# Altium project rtm-lamp.PrjPcb (part 4 of 6)

## Sheet shift-registers.SchDoc: Shift Registers
size A3; DrawnBy: Augusto Fraga Giachero; DocumentNumber: 6; SheetNumber: 6; SheetTotal: 9
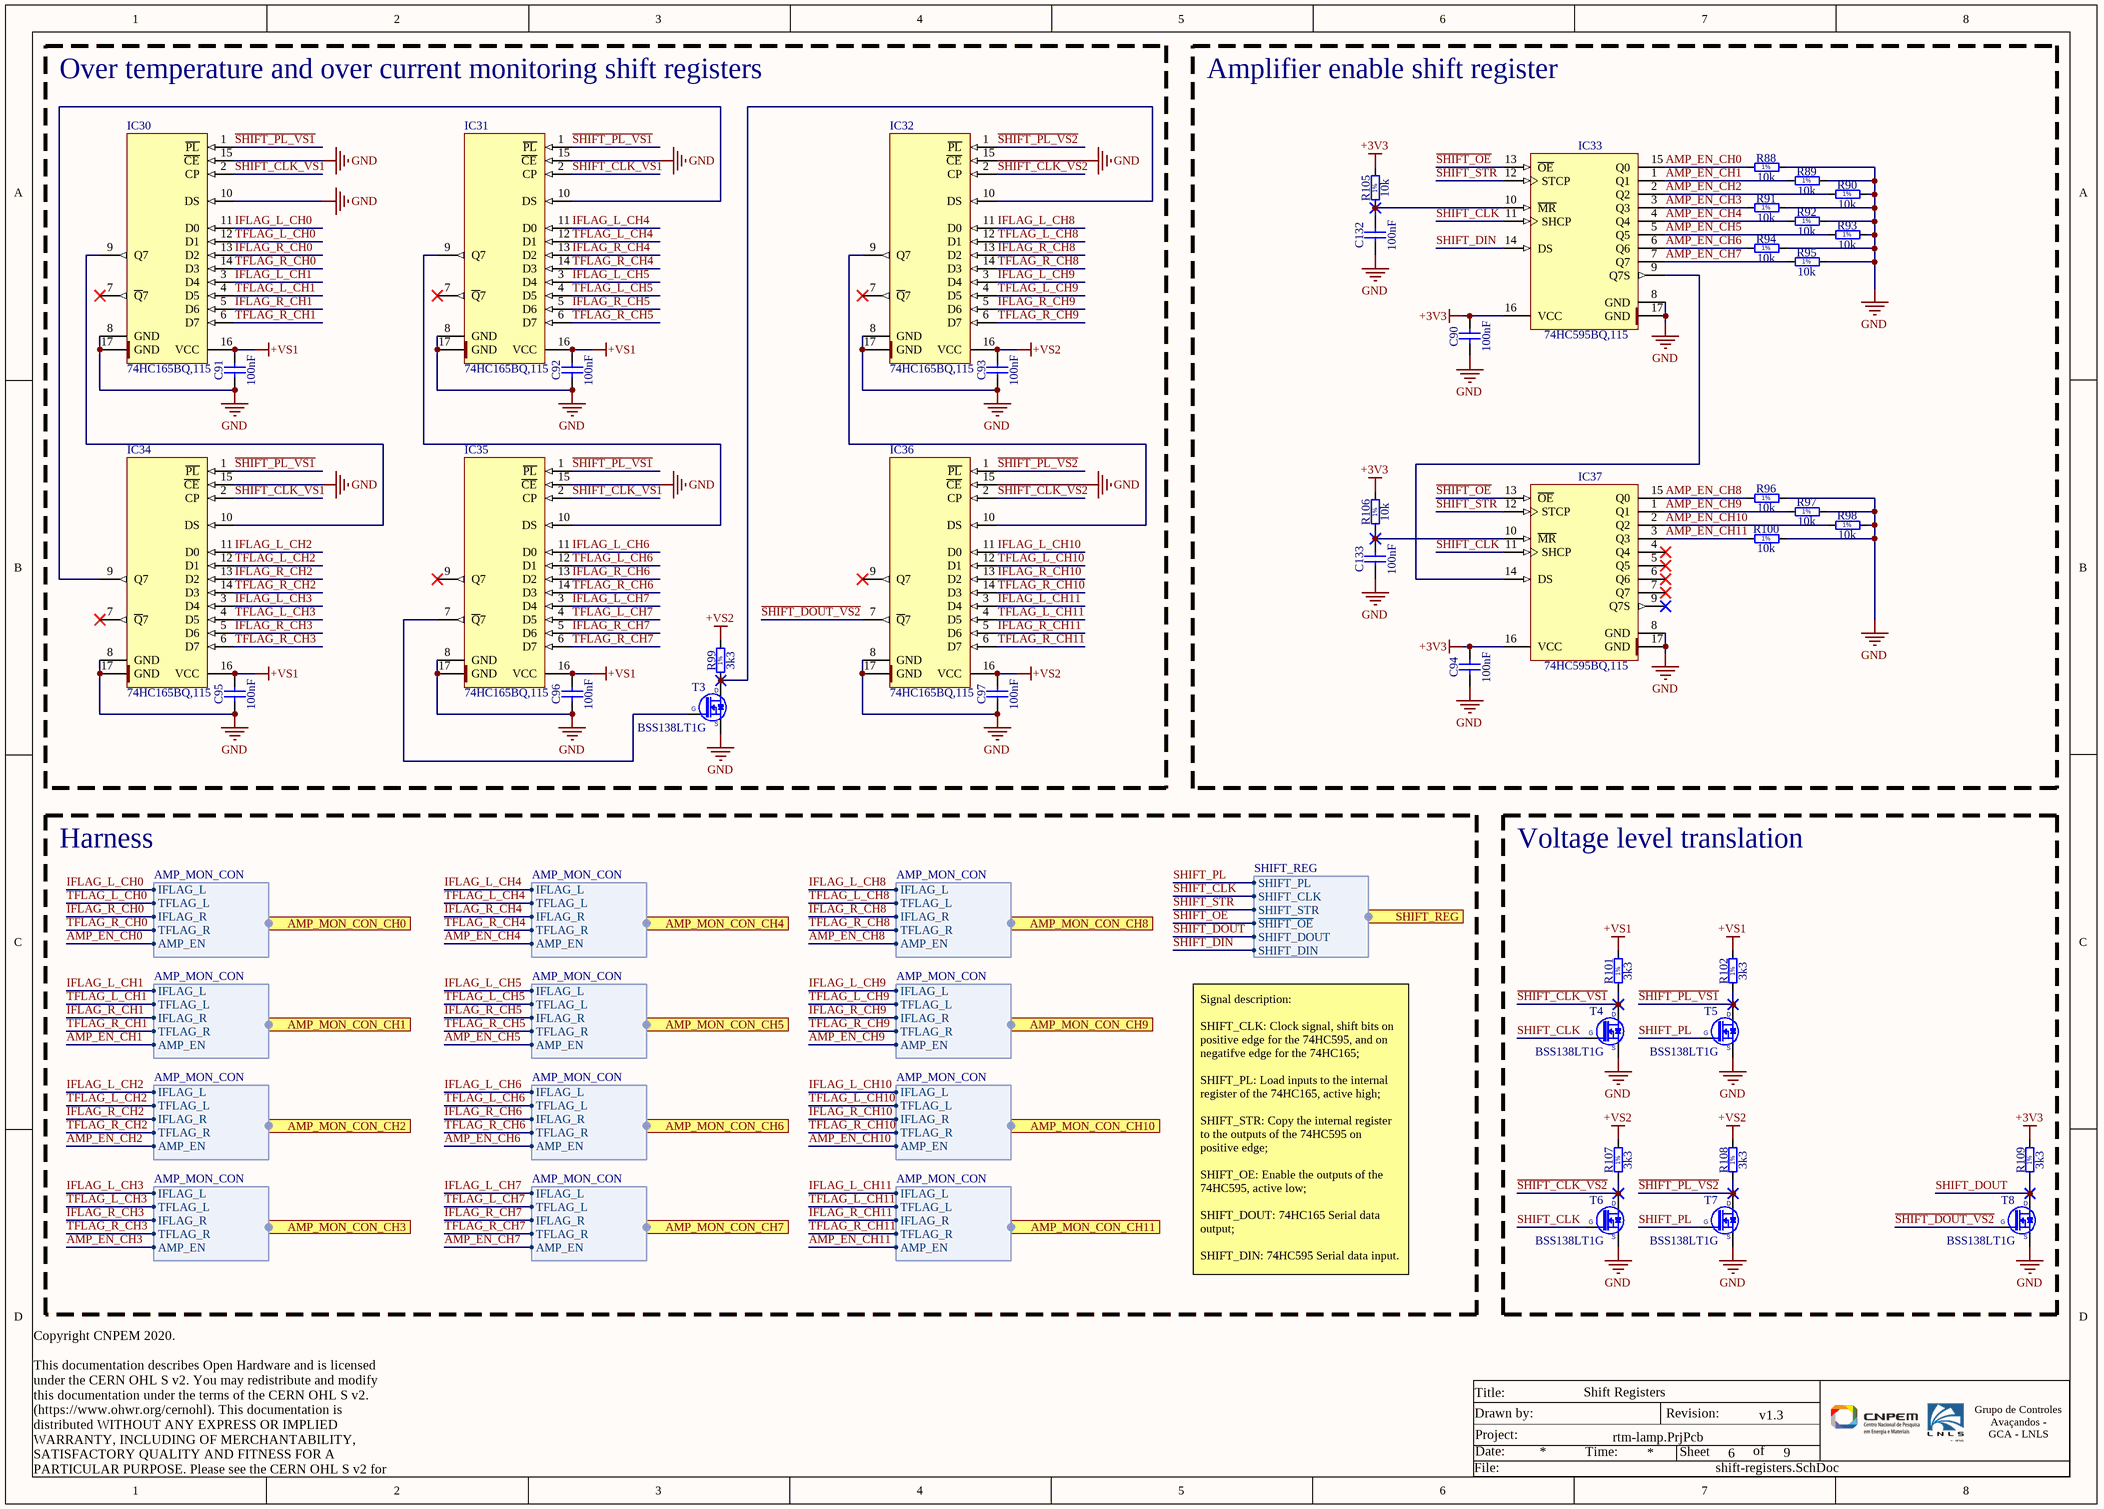
[diagram p4: shift-registers.SchDoc]

### Parts
C90  100nF  [CAPC1005X55N]
C91  100nF  [CAPC1005X55N]
C92  100nF  [CAPC1005X55N]
C93  100nF  [CAPC1005X55N]
C94  100nF  [CAPC1005X55N]
C95  100nF  [CAPC1005X55N]
C96  100nF  [CAPC1005X55N]
C97  100nF  [CAPC1005X55N]
C132  100nF  [CAPC1005X55N]
C133  100nF  [CAPC1005X55N]
IC30  74HC165BQ,115  [DHVQFN16]
IC31  74HC165BQ,115  [DHVQFN16]
IC32  74HC165BQ,115  [DHVQFN16]
IC33  74HC595BQ,115  [DHVQFN16]
IC34  74HC165BQ,115  [DHVQFN16]
IC35  74HC165BQ,115  [DHVQFN16]
IC36  74HC165BQ,115  [DHVQFN16]
IC37  74HC595BQ,115  [DHVQFN16]
R88  10k  [RESC1005X40N]
R89  10k  [RESC1005X40N]
R90  10k  [RESC1005X40N]
R91  10k  [RESC1005X40N]
R92  10k  [RESC1005X40N]
R93  10k  [RESC1005X40N]
R94  10k  [RESC1005X40N]
R95  10k  [RESC1005X40N]
R96  10k  [RESC1005X40N]
R97  10k  [RESC1005X40N]
R98  10k  [RESC1005X40N]
R99  3k3  [RESC1005X40N]
R100  10k  [RESC1005X40N]
R101  3k3  [RESC1005X40N]
R102  3k3  [RESC1005X40N]
R105  10k  [RESC1005X40N]
R106  10k  [RESC1005X40N]
R107  3k3  [RESC1005X40N]
R108  3k3  [RESC1005X40N]
R109  3k3  [RESC1005X40N]
T3  BSS138LT1G  [SOT95P240X110-3N]
T4  BSS138LT1G  [SOT95P240X110-3N]
T5  BSS138LT1G  [SOT95P240X110-3N]
T6  BSS138LT1G  [SOT95P240X110-3N]
T7  BSS138LT1G  [SOT95P240X110-3N]
T8  BSS138LT1G  [SOT95P240X110-3N]

### Blocks framed on the sheet
Over temperature and over current monitoring shift registers: C91-C93 C95-C97 IC30-IC32 IC34-IC36 R99 T3
Amplifier enable shift register: C90 C94 C132 C133 IC33 IC37 R88-R98 R100 R105 R106
Voltage level translation: R101 R102 R107-R109 T4-T8

### Ports
AMP_MON_CON_CH0 (harness AMP_MON_CON), AMP_MON_CON_CH1 (harness AMP_MON_CON), AMP_MON_CON_CH2 (harness AMP_MON_CON), AMP_MON_CON_CH3 (harness AMP_MON_CON), AMP_MON_CON_CH4 (harness AMP_MON_CON), AMP_MON_CON_CH5 (harness AMP_MON_CON), AMP_MON_CON_CH6 (harness AMP_MON_CON), AMP_MON_CON_CH7 (harness AMP_MON_CON), AMP_MON_CON_CH8 (harness AMP_MON_CON), AMP_MON_CON_CH9 (harness AMP_MON_CON), AMP_MON_CON_CH10 (harness AMP_MON_CON), AMP_MON_CON_CH11 (harness AMP_MON_CON), SHIFT_REG (out, harness SHIFT_REG)

### Harnesses
AMP_MON_CON: IFLAG_L, TFLAG_L, IFLAG_R, TFLAG_R, AMP_EN
SHIFT_REG: SHIFT_PL, SHIFT_CLK, SHIFT_STR, ~{SHIFT_OE}, SHIFT_DOUT, SHIFT_DIN

### Nets
+3V3: C90.2 C94.2 IC33.16(VCC) IC37.16(VCC) R105.2 R106.2 R109.2
+VS1: C91.2 C92.2 C95.2 C96.2 IC30.16(VCC) IC31.16(VCC) IC34.16(VCC) IC35.16(VCC) R101.2 R102.2
+VS2: C93.2 C97.2 IC32.16(VCC) IC36.16(VCC) R99.2 R107.2 R108.2
GND: C90.1 C91.1 C92.1 C93.1 C94.1 C95.1 C96.1 C97.1 C132.1 C133.1 IC30.8(GND) IC30.10(DS) IC30.15(~{CE}) IC30.17(GND) IC31.8(GND) IC31.15(~{CE}) IC31.17(GND) IC32.8(GND) IC32.15(~{CE}) IC32.17(GND) IC33.8(GND) IC33.17(GND) IC34.8(GND) IC34.15(~{CE}) IC34.17(GND) IC35.8(GND) IC35.15(~{CE}) IC35.17(GND) IC36.8(GND) IC36.15(~{CE}) IC36.17(GND) IC37.8(GND) IC37.17(GND) R88.2 R89.2 R90.2 R91.2 R92.2 R93.2 R94.2 R95.2 R96.2 R97.2 R98.2 R100.2 T3.2(S) T4.2(S) T5.2(S) T6.2(S) T7.2(S) T8.2(S)
AMP_EN_CH0: IC33.15(Q0) R88.1 ; port AMP_MON_CON_CH0.AMP_EN  [project net AMP_EN]
AMP_EN_CH1: IC33.1(Q1) R89.1 ; port AMP_MON_CON_CH1.AMP_EN  [project net AMP_EN]
AMP_EN_CH2: IC33.2(Q2) R90.1 ; port AMP_MON_CON_CH2.AMP_EN  [project net AMP_EN]
AMP_EN_CH3: IC33.3(Q3) R91.1 ; port AMP_MON_CON_CH3.AMP_EN  [project net AMP_EN]
AMP_EN_CH4: IC33.4(Q4) R92.1 ; port AMP_MON_CON_CH4.AMP_EN  [project net AMP_EN]
AMP_EN_CH5: IC33.5(Q5) R93.1 ; port AMP_MON_CON_CH5.AMP_EN  [project net AMP_EN]
AMP_EN_CH6: IC33.6(Q6) R94.1 ; port AMP_MON_CON_CH6.AMP_EN  [project net AMP_EN]
AMP_EN_CH7: IC33.7(Q7) R95.1 ; port AMP_MON_CON_CH7.AMP_EN  [project net AMP_EN]
AMP_EN_CH8: IC37.15(Q0) R96.1 ; port AMP_MON_CON_CH8.AMP_EN  [project net AMP_EN]
AMP_EN_CH9: IC37.1(Q1) R97.1 ; port AMP_MON_CON_CH9.AMP_EN  [project net AMP_EN]
AMP_EN_CH10: IC37.2(Q2) R98.1 ; port AMP_MON_CON_CH10.AMP_EN  [project net AMP_EN]
AMP_EN_CH11: IC37.3(Q3) R100.1 ; port AMP_MON_CON_CH11.AMP_EN  [project net AMP_EN]
IFLAG_L_CH0: IC30.11(D0) ; port AMP_MON_CON_CH0.IFLAG_L  [project net IFLAG_L]
IFLAG_L_CH1: IC30.3(D4) ; port AMP_MON_CON_CH1.IFLAG_L  [project net IFLAG_L]
IFLAG_L_CH2: IC34.11(D0) ; port AMP_MON_CON_CH2.IFLAG_L  [project net IFLAG_L]
IFLAG_L_CH3: IC34.3(D4) ; port AMP_MON_CON_CH3.IFLAG_L  [project net IFLAG_L]
IFLAG_L_CH4: IC31.11(D0) ; port AMP_MON_CON_CH4.IFLAG_L  [project net IFLAG_L]
IFLAG_L_CH5: IC31.3(D4) ; port AMP_MON_CON_CH5.IFLAG_L  [project net IFLAG_L]
IFLAG_L_CH6: IC35.11(D0) ; port AMP_MON_CON_CH6.IFLAG_L  [project net IFLAG_L]
IFLAG_L_CH7: IC35.3(D4) ; port AMP_MON_CON_CH7.IFLAG_L  [project net IFLAG_L]
IFLAG_L_CH8: IC32.11(D0) ; port AMP_MON_CON_CH8.IFLAG_L  [project net IFLAG_L]
IFLAG_L_CH9: IC32.3(D4) ; port AMP_MON_CON_CH9.IFLAG_L  [project net IFLAG_L]
IFLAG_L_CH10: IC36.11(D0) ; port AMP_MON_CON_CH10.IFLAG_L  [project net IFLAG_L]
IFLAG_L_CH11: IC36.3(D4) ; port AMP_MON_CON_CH11.IFLAG_L  [project net IFLAG_L]
IFLAG_R_CH0: IC30.13(D2) ; port AMP_MON_CON_CH0.IFLAG_R  [project net IFLAG_R]
IFLAG_R_CH1: IC30.5(D6) ; port AMP_MON_CON_CH1.IFLAG_R  [project net IFLAG_R]
IFLAG_R_CH2: IC34.13(D2) ; port AMP_MON_CON_CH2.IFLAG_R  [project net IFLAG_R]
IFLAG_R_CH3: IC34.5(D6) ; port AMP_MON_CON_CH3.IFLAG_R  [project net IFLAG_R]
IFLAG_R_CH4: IC31.13(D2) ; port AMP_MON_CON_CH4.IFLAG_R  [project net IFLAG_R]
IFLAG_R_CH5: IC31.5(D6) ; port AMP_MON_CON_CH5.IFLAG_R  [project net IFLAG_R]
IFLAG_R_CH6: IC35.13(D2) ; port AMP_MON_CON_CH6.IFLAG_R  [project net IFLAG_R]
IFLAG_R_CH7: IC35.5(D6) ; port AMP_MON_CON_CH7.IFLAG_R  [project net IFLAG_R]
IFLAG_R_CH8: IC32.13(D2) ; port AMP_MON_CON_CH8.IFLAG_R  [project net IFLAG_R]
IFLAG_R_CH9: IC32.5(D6) ; port AMP_MON_CON_CH9.IFLAG_R  [project net IFLAG_R]
IFLAG_R_CH10: IC36.13(D2) ; port AMP_MON_CON_CH10.IFLAG_R  [project net IFLAG_R]
IFLAG_R_CH11: IC36.5(D6) ; port AMP_MON_CON_CH11.IFLAG_R  [project net IFLAG_R]
~{SHIFT_CLK_VS1}: IC30.2(CP) IC31.2(CP) IC34.2(CP) IC35.2(CP) R101.1 T4.3(D)
~{SHIFT_CLK_VS2}: IC32.2(CP) IC36.2(CP) R107.1 T6.3(D)
~{SHIFT_DOUT_VS2}: IC36.7(~{Q}7) T8.1(G)
~{SHIFT_OE}: IC33.13(~{OE}) IC37.13(~{OE}) ; port SHIFT_REG.~{SHIFT_OE}
~{SHIFT_PL_VS1}: IC30.1(~{PL}) IC31.1(~{PL}) IC34.1(~{PL}) IC35.1(~{PL}) R102.1 T5.3(D)
~{SHIFT_PL_VS2}: IC32.1(~{PL}) IC36.1(~{PL}) R108.1 T7.3(D)
SHIFT_CLK: IC33.11(SHCP) IC37.11(SHCP) T4.1(G) T6.1(G) ; port SHIFT_REG.SHIFT_CLK
SHIFT_DIN: IC33.14(DS) ; port SHIFT_REG.SHIFT_DIN
SHIFT_DOUT: R109.1 T8.3(D) ; port SHIFT_REG.SHIFT_DOUT
SHIFT_PL: T5.1(G) T7.1(G) ; port SHIFT_REG.SHIFT_PL  [project net P30_IO5_CD_B1_N]
SHIFT_STR: IC33.12(STCP) IC37.12(STCP) ; port SHIFT_REG.SHIFT_STR
TFLAG_L_CH0: IC30.12(D1) ; port AMP_MON_CON_CH0.TFLAG_L  [project net TFLAG_L]
TFLAG_L_CH1: IC30.4(D5) ; port AMP_MON_CON_CH1.TFLAG_L  [project net TFLAG_L]
TFLAG_L_CH2: IC34.12(D1) ; port AMP_MON_CON_CH2.TFLAG_L  [project net TFLAG_L]
TFLAG_L_CH3: IC34.4(D5) ; port AMP_MON_CON_CH3.TFLAG_L  [project net TFLAG_L]
TFLAG_L_CH4: IC31.12(D1) ; port AMP_MON_CON_CH4.TFLAG_L  [project net TFLAG_L]
TFLAG_L_CH5: IC31.4(D5) ; port AMP_MON_CON_CH5.TFLAG_L  [project net TFLAG_L]
TFLAG_L_CH6: IC35.12(D1) ; port AMP_MON_CON_CH6.TFLAG_L  [project net TFLAG_L]
TFLAG_L_CH7: IC35.4(D5) ; port AMP_MON_CON_CH7.TFLAG_L  [project net TFLAG_L]
TFLAG_L_CH8: IC32.12(D1) ; port AMP_MON_CON_CH8.TFLAG_L  [project net TFLAG_L]
TFLAG_L_CH9: IC32.4(D5) ; port AMP_MON_CON_CH9.TFLAG_L  [project net TFLAG_L]
TFLAG_L_CH10: IC36.12(D1) ; port AMP_MON_CON_CH10.TFLAG_L  [project net TFLAG_L]
TFLAG_L_CH11: IC36.4(D5) ; port AMP_MON_CON_CH11.TFLAG_L  [project net TFLAG_L]
TFLAG_R_CH0: IC30.14(D3) ; port AMP_MON_CON_CH0.TFLAG_R  [project net TFLAG_R]
TFLAG_R_CH1: IC30.6(D7) ; port AMP_MON_CON_CH1.TFLAG_R  [project net TFLAG_R]
TFLAG_R_CH2: IC34.14(D3) ; port AMP_MON_CON_CH2.TFLAG_R  [project net TFLAG_R]
TFLAG_R_CH3: IC34.6(D7) ; port AMP_MON_CON_CH3.TFLAG_R  [project net TFLAG_R]
TFLAG_R_CH4: IC31.14(D3) ; port AMP_MON_CON_CH4.TFLAG_R  [project net TFLAG_R]
TFLAG_R_CH5: IC31.6(D7) ; port AMP_MON_CON_CH5.TFLAG_R  [project net TFLAG_R]
TFLAG_R_CH6: IC35.14(D3) ; port AMP_MON_CON_CH6.TFLAG_R  [project net TFLAG_R]
TFLAG_R_CH7: IC35.6(D7) ; port AMP_MON_CON_CH7.TFLAG_R  [project net TFLAG_R]
TFLAG_R_CH8: IC32.14(D3) ; port AMP_MON_CON_CH8.TFLAG_R  [project net TFLAG_R]
TFLAG_R_CH9: IC32.6(D7) ; port AMP_MON_CON_CH9.TFLAG_R  [project net TFLAG_R]
TFLAG_R_CH10: IC36.14(D3) ; port AMP_MON_CON_CH10.TFLAG_R  [project net TFLAG_R]
TFLAG_R_CH11: IC36.6(D7) ; port AMP_MON_CON_CH11.TFLAG_R  [project net TFLAG_R]
NetC132_2: C132.2 IC33.10(~{MR}) R105.1
NetC133_2: C133.2 IC37.10(~{MR}) R106.1
NetIC30_9: IC30.9(Q7) IC34.10(DS)
NetIC31_9: IC31.9(Q7) IC35.10(DS)
NetIC31_10: IC31.10(DS) IC34.9(Q7)
NetIC32_9: IC32.9(Q7) IC36.10(DS)
NetIC32_10: IC32.10(DS) R99.1 T3.3(D)
NetIC33_9: IC33.9(Q7S) IC37.14(DS)
NetIC35_7: IC35.7(~{Q}7) T3.1(G)

Not connected (* = marked no-connect by the designer): IC30 7(~{Q}7)*; IC31 7(~{Q}7)*; IC32 7(~{Q}7)*; IC34 7(~{Q}7)*; IC35 9(Q7)*; IC36 9(Q7)*; IC37 4(Q4)* 5(Q5)* 6(Q6)* 7(Q7)* 9(Q7S)*

### Notes on the sheet
- Harness
- Signal description:
  SHIFT_CLK: Clock signal, shift bits on positive edge for the 74HC595, and on negatifve edge for the 74HC165;
  SHIFT_PL: Load inputs to the internal register of the 74HC165, active high;
  SHIFT_STR: Copy the internal register to the outputs of the 74HC595 on positive edge;
  SHIFT_OE: Enable the outputs of the 74HC595, active low;
  SHIFT_DOUT: 74HC165 Serial data output;
  SHIFT_DIN: 74HC595 Serial data input.
- Title:
- Date:
- Project:
- Drawn by:
- Time:
- Revision:
- Sheet
- of
- Grupo de Controles Avaçandos -
  GCA - LNLS
- Copyright CNPEM 2020.
  This documentation describes Open Hardware and is licensed under the CERN OHL S v2. You may redistribute and modify this documentation under the terms of the CERN OHL S v2. (https://www.ohwr.org/cernohl). This documentation is distributed WITHOUT ANY EXPRESS OR IMPLIED WARRANTY, INCLUDING OF MERCHANTABILITY, SATISFACTORY QUALITY AND FITNESS FOR A PARTICULAR PURPOSE. Please see the CERN OHL S v2 for applicable conditions.
- File:
- (in symbol R0402_3K3_1%_0.0625W_100PPM) 1%
- (in symbol R0402_10K_1%_0.0625W_100PPM) 1%

### Library data of the parts
C90-C97 C132 C133 = CC0402_100NF_16V_10%_X7R: SMD Multilayer Chip Ceramic Capacitor; Manufacturer: GENERIC; Manufacturer1 Part Number: GRM155R71C104KA88D; Voltage: 16V; TC: X7R; Tolerance: ±10%; Part Number: CC0402_100NF_16V_10%_X7R; Component Kind: Standard; Component Type: Standard; Pin Count: 2; Value: 100nF; Status: Not Recommended; Manufacturer Part Number: CC0402_100NF_16V_10%_X7R; Case: 0402; Mounted: Yes; Socket: No; SMD: Yes; Sense: No; Manufacturer1 Example: MURATA; Manufacturer1 ComponentHeight: 0.55mm; HelpURL: \\cern.ch\dfs\Applications\Altium\Datasheets\CC0402_X7R_MURATA_GRM.pdf; Author: CERN DEM JLC; CreateDate: 05/12/2013; LatestRevisionDate: 03/12/2007
IC30-IC32 IC34-IC36 = 74HC165BQ,115: 8-bit parallel-in/serial out shift register; Manufacturer: NEXPERIA; PressFit: No; Bonding: No; Part Number: 74HC165BQ,115; Component Kind: Standard; Component Type: Standard; Device: 74HC165BQ,115; Footprint: DHVQFN-16; PackageDescription: Plastic dual in-line compatible thermal enhanced very thin quad flat package, no leads, 16 terminals, body 2.5 x 3.5 x 0.85 mm; Manufacturer Part Number: 74HC165BQ,115; Pin Count: 17; Case: DHVQFN-16; Mounted: Yes; Socket: No; SMD: Yes; Sense: No; ComponentHeight: 1mm; Author: LNLS DIG AFG; CreateDate: 03/07/2020; LatestRevisionDate: 03/07/2020
IC33 IC37 = 74HC595BQ,115: 8-Bit serial-in, serial or parallel-out shift register with output  latches, Three-state; Manufacturer: NEXPERIA; PressFit: No; Bonding: No; Part Number: 74HC595BQ,115; Component Kind: Standard; Component Type: Standard; Device: 74HC595BQ,115; PackageDescription: Plastic dual in-line compatible thermal enhanced very thin quad flat package, no leads, 16 terminals, body 2.5 x 3.5 x 0.85 mm; Manufacturer Part Number: 74HC595BQ,115; Pin Count: 17; Case: DHVQFN-16; Mounted: Yes; Socket: No; SMD: Yes; Sense: No; ComponentHeight: 1mm; Author: LNLS DIG AFG; CreateDate: 06/07/2020; LatestRevisionDate: 06/07/2020
R88-R98 R100 R105 R106 = R0402_10K_1%_0.0625W_100PPM: General Purpose Thick Film Chip Resistor; Manufacturer: GENERIC; Manufacturer1 Part Number: 232270671003L; TC: ±100ppm/°C; Tolerance: ±1%; Part Number: R0402_10K_1%_0.0625W_100PPM; Component Kind: Standard; Component Type: Standard; Pin Count: 2; Value: 10k; Status: Not recommended; Power: 0.0625W; Manufacturer Part Number: R0402_10K_1%_0.0625W_100PPM; Case: 0402; Mounted: Yes; Sense: No; Socket: No; SMD: Yes; Manufacturer1 Example: YAGEO PHYCOMP; Manufacturer1 ComponentHeight: 0.4mm; HelpURL: \\cern.ch\dfs\Applications\Altium\Datasheets\R0402_Phycomp_RC0402.pdf; Author: CERN DEM JLC; CreateDate: 03/12/2007; LatestRevisionDate: 17/10/2012
R99 R101 R102 R107-R109 = R0402_3K3_1%_0.0625W_100PPM: General Purpose Thick Film Chip Resistor; Manufacturer: GENERIC; Manufacturer1 Part Number: 232270673302L; TC: ±100ppm/°C; Tolerance: ±1%; Part Number: R0402_3K3_1%_0.0625W_100PPM; Component Kind: Standard; Component Type: Standard; Pin Count: 2; Value: 3k3; Status: Not recommended; Power: 0.0625W; Manufacturer Part Number: R0402_3K3_1%_0.0625W_100PPM; Case: 0402; Mounted: Yes; Sense: No; Socket: No; SMD: Yes; Manufacturer1 Example: YAGEO PHYCOMP; Manufacturer1 ComponentHeight: 0.4mm; HelpURL: \\cern.ch\dfs\Applications\Altium\Datasheets\R0402_Phycomp_RC0402.pdf; Author: CERN DEM JLC; CreateDate: 03/12/2007; LatestRevisionDate: 17/10/2012
T3-T8 = BSS138LT1G: 50V 200mA N-Channel Enhancement Mode Field-Effect Transistor; Manufacturer: ON SEMICONDUCTOR; PressFit: No; Bonding: No; Manufacturer Part Number: BSS138LT1G; PackageDescription: SOT23 3-Leads, Pitch 0.95mm - Body 1.4x3mm, IPC Medium Density; Part Number: BSS138LT1G; Component Kind: Standard; Component Type: Standard; Device: BSS138LT1G; Pin Count: 3; Case: SOT23-3; Mounted: Yes; Socket: No; SMD: Yes; Sense: No; ComponentHeight: 1.11mm; HelpURL: \\cern.ch\dfs\Applications\Altium\Datasheets\BSS138LT1G.pdf; Author: CERN DEM JLC; CreateDate: 23/03/2009; LatestRevisionDate: 23/03/2009

## Sheet adc.SchDoc: Current Feedback ADC
size A3; DrawnBy: Augusto Fraga Giachero; DocumentNumber: 7; SheetNumber: 7; SheetTotal: 9
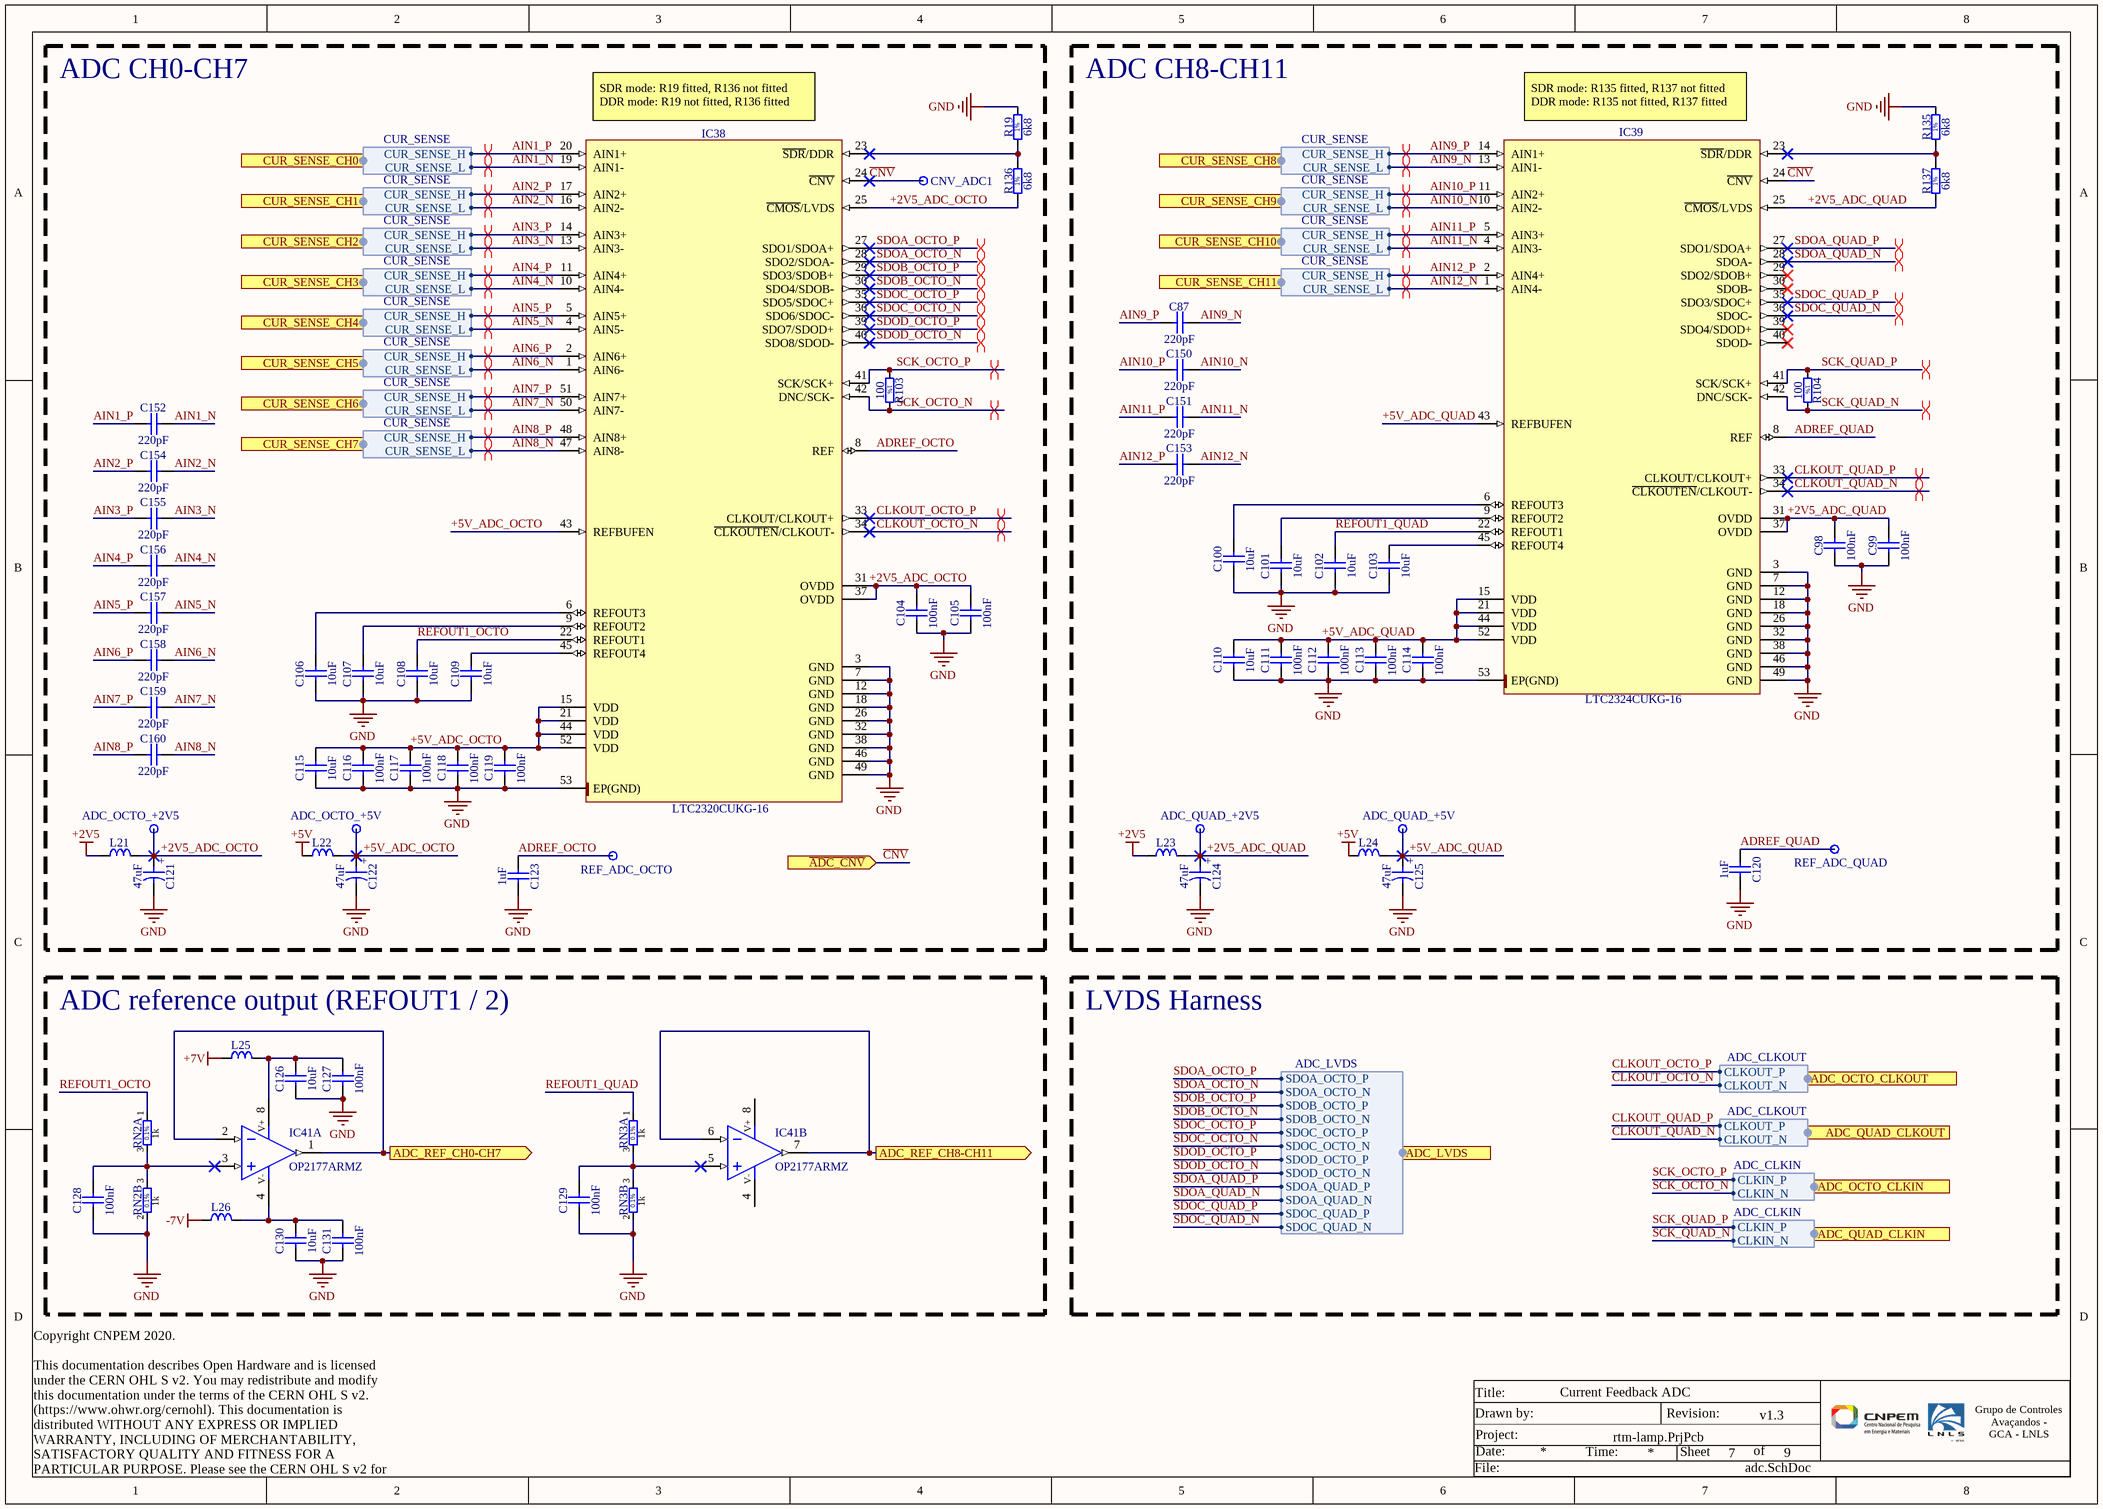
[diagram p5: adc.SchDoc]

### Parts
ADC_OCTO_+2V5  Test Point  [TPS127]  (value not drawn)
ADC_OCTO_+5V  Test Point  [TPS127]  (value not drawn)
ADC_QUAD_+2V5  Test Point  [TPS127]  (value not drawn)
ADC_QUAD_+5V  Test Point  [TPS127]  (value not drawn)
C87  220pF  [CAPC1005X55N]
C98  100nF  [CAPC1005X55N]
C99  100nF  [CAPC1005X55N]
C100  10uF  [CAPC2012X95N]
C101  10uF  [CAPC2012X95N]
C102  10uF  [CAPC2012X95N]
C103  10uF  [CAPC2012X95N]
C104  100nF  [CAPC1005X55N]
C105  100nF  [CAPC1005X55N]
C106  10uF  [CAPC2012X95N]
C107  10uF  [CAPC2012X95N]
C108  10uF  [CAPC2012X95N]
C109  10uF  [CAPC2012X95N]
C110  10uF  [CAPC2012X95N]
C111  100nF  [CAPC1005X55N]
C112  100nF  [CAPC1005X55N]
C113  100nF  [CAPC1005X55N]
C114  100nF  [CAPC1005X55N]
C115  10uF  [CAPC2012X95N]
C116  100nF  [CAPC1005X55N]
C117  100nF  [CAPC1005X55N]
C118  100nF  [CAPC1005X55N]
C119  100nF  [CAPC1005X55N]
C120  1uF  [CAPC2012X135N]
C121  47uF  [CAPMP3528X210N]
C122  47uF  [CAPMP3528X210N]
C123  1uF  [CAPC2012X135N]
C124  47uF  [CAPMP3528X210N]
C125  47uF  [CAPMP3528X210N]
C126  10uF  [CAPC2012X95N]
C127  100nF  [CAPC1608X87N]
C128  100nF  [CAPC2012X135N]
C129  100nF  [CAPC2012X135N]
C130  10uF  [CAPC2012X95N]
C131  100nF  [CAPC1608X87N]
C150  220pF  [CAPC1005X55N]
C151  220pF  [CAPC1005X55N]
C152  220pF  [CAPC1005X55N]
C153  220pF  [CAPC1005X55N]
C154  220pF  [CAPC1005X55N]
C155  220pF  [CAPC1005X55N]
C156  220pF  [CAPC1005X55N]
C157  220pF  [CAPC1005X55N]
C158  220pF  [CAPC1005X55N]
C159  220pF  [CAPC1005X55N]
C160  220pF  [CAPC1005X55N]
CNV_ADC1  Test Point  [TPS127]  (value not drawn)
IC38  LTC2320CUKG-16  [QFN50P700X800X80-53N-R655X550]
IC39  LTC2324CUKG-16  [QFN50P700X800X80-53N-R655X550]
IC41  OP2177ARMZ  [SOP65P490X110-8N]  (parts A,B of 2)
L21  1K@100MHz  [INDC1608X95N]  (value not drawn)
L22  1K@100MHz  [INDC1608X95N]  (value not drawn)
L23  1K@100MHz  [INDC1608X95N]  (value not drawn)
L24  1K@100MHz  [INDC1608X95N]  (value not drawn)
L25  1K@100MHz  [INDC1608X95N]  (value not drawn)
L26  1K@100MHz  [INDC1608X95N]  (value not drawn)
R19  6k8  [RESC1005X40N]
R103  100  [RESC1005X40N]
R104  100  [RESC1005X40N]
R135  6k8  [RESC1005X40N]
R136  6k8  [RESC1005X40N]
R137  6k8  [RESC1005X40N]
REF_ADC_OCTO  Test Point  [TPS127]  (value not drawn)
REF_ADC_QUAD  Test Point  [TPS127]  (value not drawn)
RN2  1k 1k  [SOT95P230X112-3N]  (value not drawn)  (parts A,B of 2)
RN3  1k 1k  [SOT95P230X112-3N]  (value not drawn)  (parts A,B of 2)

### Blocks framed on the sheet
ADC CH0-CH7: ADC_OCTO_+2V5 ADC_OCTO_+5V C104-C109 C115-C119 C121-C123 C152 C154-C160 CNV_ADC1 IC38 L21 L22 R19 R103 R136 REF_ADC_OCTO
ADC CH8-CH11: ADC_QUAD_+2V5 ADC_QUAD_+5V C87 C98-C103 C110-C114 C120 C124 C125 C150 C151 C153 IC39 L23 L24 R104 R135 R137 REF_ADC_QUAD
ADC reference output (REFOUT1 / 2): C126-C131 IC41 L25 L26 RN2 RN3

### Ports
ADC_LVDS (harness ADC_LVDS), ADC_OCTO_CLKIN (harness ADC_CLKIN), ADC_OCTO_CLKOUT (harness ADC_CLKOUT), ADC_QUAD_CLKIN (harness ADC_CLKIN), ADC_QUAD_CLKOUT (harness ADC_CLKOUT), ADC_REF_CH0-CH7 (out), ADC_REF_CH8-CH11 (out), CUR_SENSE_CH0 (harness CUR_SENSE), CUR_SENSE_CH1 (harness CUR_SENSE), CUR_SENSE_CH2 (harness CUR_SENSE), CUR_SENSE_CH3 (harness CUR_SENSE), CUR_SENSE_CH4 (harness CUR_SENSE), CUR_SENSE_CH5 (harness CUR_SENSE), CUR_SENSE_CH6 (harness CUR_SENSE), CUR_SENSE_CH7 (harness CUR_SENSE), CUR_SENSE_CH8 (harness CUR_SENSE), CUR_SENSE_CH9 (harness CUR_SENSE), CUR_SENSE_CH10 (harness CUR_SENSE), CUR_SENSE_CH11 (harness CUR_SENSE), ~{ADC_CNV} (in)

### Harnesses
CUR_SENSE: CUR_SENSE_H, CUR_SENSE_L
ADC_LVDS: SDOA_OCTO_P, SDOA_OCTO_N, SDOB_OCTO_P, SDOB_OCTO_N, SDOC_OCTO_P, SDOC_OCTO_N, SDOD_OCTO_P, SDOD_OCTO_N, SDOA_QUAD_P, SDOA_QUAD_N, SDOC_QUAD_P, SDOC_QUAD_N
ADC_CLKOUT: CLKOUT_P, CLKOUT_N
ADC_CLKIN: CLKIN_P, CLKIN_N

### Nets
+2V5: L21.1 L23.1
+5V: L22.1 L24.1
+7V: L25.1
-7V: L26.1
GND: C98.1 C99.1 C100.1 C101.1 C102.1 C103.1 C104.1 C105.1 C106.1 C107.1 C108.1 C109.1 C110.1 C111.1 C112.1 C113.1 C114.1 C115.1 C116.1 C117.1 C118.1 C119.1 C120.2 C121.2 C122.2 C123.2 C124.2 C125.2 C126.1 C127.1 C128.1 C129.1 C130.1 C131.1 IC38.3(GND) IC38.7(GND) IC38.12(GND) IC38.18(GND) IC38.26(GND) IC38.32(GND) IC38.38(GND) IC38.46(GND) IC38.49(GND) IC38.53(EP(GND)) IC39.3(GND) IC39.7(GND) IC39.12(GND) IC39.18(GND) IC39.26(GND) IC39.32(GND) IC39.38(GND) IC39.46(GND) IC39.49(GND) IC39.53(EP(GND)) R19.2 R135.2 RN2.2 RN3.2
+2V5_ADC_OCTO: ADC_OCTO_+2V5.1 C104.2 C105.2 C121.1 IC38.25(~{CMOS}/LVDS) IC38.31(OVDD) IC38.37(OVDD) L21.2 R136.1
+2V5_ADC_QUAD: ADC_QUAD_+2V5.1 C98.2 C99.2 C124.1 IC39.25(~{CMOS}/LVDS) IC39.31(OVDD) IC39.37(OVDD) L23.2 R137.1
+5V_ADC_OCTO: ADC_OCTO_+5V.1 C115.2 C116.2 C117.2 C118.2 C119.2 C122.1 IC38.15(VDD) IC38.21(VDD) IC38.43(REFBUFEN) IC38.44(VDD) IC38.52(VDD) L22.2
+5V_ADC_QUAD: ADC_QUAD_+5V.1 C110.2 C111.2 C112.2 C113.2 C114.2 C125.1 IC39.15(VDD) IC39.21(VDD) IC39.43(REFBUFEN) IC39.44(VDD) IC39.52(VDD) L24.2
ADC_REF_CH0-CH7: IC41.1(OUT) IC41.2(IN-) ; port ADC_REF_CH0-CH7
ADC_REF_CH8-CH11: IC41.6(IN-) IC41.7(OUT) ; port ADC_REF_CH8-CH11
ADREF_OCTO: C123.1 IC38.8(REF) REF_ADC_OCTO.1
ADREF_QUAD: C120.1 IC39.8(REF) REF_ADC_QUAD.1
AIN1_N: C152.2 IC38.19(AIN1-) ; port CUR_SENSE_CH0.CUR_SENSE_L
AIN1_P: C152.1 IC38.20(AIN1+) ; port CUR_SENSE_CH0.CUR_SENSE_H
AIN2_N: C154.2 IC38.16(AIN2-) ; port CUR_SENSE_CH1.CUR_SENSE_L
AIN2_P: C154.1 IC38.17(AIN2+) ; port CUR_SENSE_CH1.CUR_SENSE_H
AIN3_N: C155.2 IC38.13(AIN3-) ; port CUR_SENSE_CH2.CUR_SENSE_L
AIN3_P: C155.1 IC38.14(AIN3+) ; port CUR_SENSE_CH2.CUR_SENSE_H
AIN4_N: C156.2 IC38.10(AIN4-) ; port CUR_SENSE_CH3.CUR_SENSE_L
AIN4_P: C156.1 IC38.11(AIN4+) ; port CUR_SENSE_CH3.CUR_SENSE_H
AIN5_N: C157.2 IC38.4(AIN5-) ; port CUR_SENSE_CH4.CUR_SENSE_L
AIN5_P: C157.1 IC38.5(AIN5+) ; port CUR_SENSE_CH4.CUR_SENSE_H
AIN6_N: C158.2 IC38.1(AIN6-) ; port CUR_SENSE_CH5.CUR_SENSE_L
AIN6_P: C158.1 IC38.2(AIN6+) ; port CUR_SENSE_CH5.CUR_SENSE_H
AIN7_N: C159.2 IC38.50(AIN7-) ; port CUR_SENSE_CH6.CUR_SENSE_L
AIN7_P: C159.1 IC38.51(AIN7+) ; port CUR_SENSE_CH6.CUR_SENSE_H
AIN8_N: C160.2 IC38.47(AIN8-) ; port CUR_SENSE_CH7.CUR_SENSE_L
AIN8_P: C160.1 IC38.48(AIN8+) ; port CUR_SENSE_CH7.CUR_SENSE_H
AIN9_N: C87.2 IC39.13(AIN1-) ; port CUR_SENSE_CH8.CUR_SENSE_L
AIN9_P: C87.1 IC39.14(AIN1+) ; port CUR_SENSE_CH8.CUR_SENSE_H
AIN10_N: C150.2 IC39.10(AIN2-) ; port CUR_SENSE_CH9.CUR_SENSE_L
AIN10_P: C150.1 IC39.11(AIN2+) ; port CUR_SENSE_CH9.CUR_SENSE_H
AIN11_N: C151.2 IC39.4(AIN3-) ; port CUR_SENSE_CH10.CUR_SENSE_L
AIN11_P: C151.1 IC39.5(AIN3+) ; port CUR_SENSE_CH10.CUR_SENSE_H
AIN12_N: C153.2 IC39.1(AIN4-) ; port CUR_SENSE_CH11.CUR_SENSE_L
AIN12_P: C153.1 IC39.2(AIN4+) ; port CUR_SENSE_CH11.CUR_SENSE_H
~{CNV}: CNV_ADC1.1 IC38.24(~{CNV}) IC39.24(~{CNV}) ; port ~{ADC_CNV}  [project net ~{ADC_CNV_OUT}]
CLKOUT_OCTO_N: IC38.34(~{CLKOUTEN}/CLKOUT-) ; port ADC_OCTO_CLKOUT.CLKOUT_N
CLKOUT_OCTO_P: IC38.33(CLKOUT/CLKOUT+) ; port ADC_OCTO_CLKOUT.CLKOUT_P
CLKOUT_QUAD_N: IC39.34(~{CLKOUTEN}/CLKOUT-) ; port ADC_QUAD_CLKOUT.CLKOUT_N
CLKOUT_QUAD_P: IC39.33(CLKOUT/CLKOUT+) ; port ADC_QUAD_CLKOUT.CLKOUT_P
REFOUT1_OCTO: C108.2 IC38.22(REFOUT1) RN2.1
REFOUT1_QUAD: C102.2 IC39.22(REFOUT1) RN3.1
SCK_OCTO_N: IC38.42(DNC/SCK-) R103.2 ; port ADC_OCTO_CLKIN.CLKIN_N  [project net RTM_LVD3_N]
SCK_OCTO_P: IC38.41(SCK/SCK+) R103.1 ; port ADC_OCTO_CLKIN.CLKIN_P  [project net RTM_LVD3_P]
SCK_QUAD_N: IC39.42(DNC/SCK-) R104.2 ; port ADC_QUAD_CLKIN.CLKIN_N  [project net RTM_LVD4_N]
SCK_QUAD_P: IC39.41(SCK/SCK+) R104.1 ; port ADC_QUAD_CLKIN.CLKIN_P  [project net RTM_LVD4_P]
SDOA_OCTO_N: IC38.28(SDO2/SDOA-) ; port ADC_LVDS.SDOA_OCTO_N  [project net RTM_LVD6_N]
SDOA_OCTO_P: IC38.27(SDO1/SDOA+) ; port ADC_LVDS.SDOA_OCTO_P  [project net RTM_LVD6_P]
SDOA_QUAD_N: IC39.28(SDOA-) ; port ADC_LVDS.SDOA_QUAD_N  [project net P31_IO4_AB_B2_N]
SDOA_QUAD_P: IC39.27(SDO1/SDOA+) ; port ADC_LVDS.SDOA_QUAD_P  [project net P31_IO4_AB_B2_P]
SDOB_OCTO_N: IC38.30(SDO4/SDOB-) ; port ADC_LVDS.SDOB_OCTO_N  [project net RTM_LVD5_N]
SDOB_OCTO_P: IC38.29(SDO3/SDOB+) ; port ADC_LVDS.SDOB_OCTO_P  [project net RTM_LVD5_P]
SDOC_OCTO_N: IC38.36(SDO6/SDOC-) ; port ADC_LVDS.SDOC_OCTO_N  [project net RTM_LVD1_N]
SDOC_OCTO_P: IC38.35(SDO5/SDOC+) ; port ADC_LVDS.SDOC_OCTO_P  [project net RTM_LVD1_P]
SDOC_QUAD_N: IC39.36(SDOC-) ; port ADC_LVDS.SDOC_QUAD_N  [project net P31_IO3_AB_B2_N]
SDOC_QUAD_P: IC39.35(SDO3/SDOC+) ; port ADC_LVDS.SDOC_QUAD_P  [project net P31_IO3_AB_B2_P]
SDOD_OCTO_N: IC38.40(SDO8/SDOD-) ; port ADC_LVDS.SDOD_OCTO_N  [project net RTM_LVD2_N]
SDOD_OCTO_P: IC38.39(SDO7/SDOD+) ; port ADC_LVDS.SDOD_OCTO_P  [project net RTM_LVD2_P]
NetC100_2: C100.2 IC39.6(REFOUT3)
NetC101_2: C101.2 IC39.9(REFOUT2)
NetC103_2: C103.2 IC39.45(REFOUT4)
NetC106_2: C106.2 IC38.6(REFOUT3)
NetC107_2: C107.2 IC38.9(REFOUT2)
NetC109_2: C109.2 IC38.45(REFOUT4)
NetC126_2: C126.2 C127.2 IC41.8(V+) L25.2
NetC128_2: C128.2 IC41.3(IN+) RN2.3
NetC129_2: C129.2 IC41.5(IN+) RN3.3
NetC130_2: C130.2 C131.2 IC41.4(V-) L26.2
NetIC38_23: IC38.23(~{SDR}/DDR) R19.1 R136.2
NetIC39_23: IC39.23(~{SDR}/DDR) R135.1 R137.2

Not connected (* = marked no-connect by the designer): IC39 29(SDO2/SDOB+)* 30(SDOB-)* 39(SDO4/SDOD+)* 40(SDOD-)*

### Layout directives
differential pair; differential pair class DIFFADC: AIN1_N, AIN1_P, AIN2_N, AIN2_P, AIN3_N, AIN3_P, AIN4_N, AIN4_P, AIN5_N, AIN5_P, AIN6_N, AIN6_P, AIN7_N, AIN7_P, AIN8_N, AIN8_P, AIN9_N, AIN9_P, AIN10_N, AIN10_P, AIN11_N, AIN11_P, AIN12_N, AIN12_P
differential pair; differential pair class DIFF100: CLKOUT_OCTO_N, CLKOUT_OCTO_P, CLKOUT_QUAD_N, CLKOUT_QUAD_P, P31_IO3_AB_B2_N, P31_IO3_AB_B2_P, P31_IO4_AB_B2_N, P31_IO4_AB_B2_P, RTM_LVD1_N, RTM_LVD1_P, RTM_LVD2_N, RTM_LVD2_P, RTM_LVD3_N, RTM_LVD3_P, RTM_LVD4_N, RTM_LVD4_P, RTM_LVD5_N, RTM_LVD5_P, RTM_LVD6_N, RTM_LVD6_P

### Notes on the sheet
- (near IC38) SDR mode: R19 fitted, R136 not fitted
  DDR mode: R19 not fitted, R136 fitted
- (near IC39) SDR mode: R135 fitted, R137 not fitted
  DDR mode: R135 not fitted, R137 fitted
- LVDS Harness
- Title:
- Date:
- Project:
- Drawn by:
- Time:
- Revision:
- Sheet
- of
- Grupo de Controles Avaçandos -
  GCA - LNLS
- Copyright CNPEM 2020.
  This documentation describes Open Hardware and is licensed under the CERN OHL S v2. You may redistribute and modify this documentation under the terms of the CERN OHL S v2. (https://www.ohwr.org/cernohl). This documentation is distributed WITHOUT ANY EXPRESS OR IMPLIED WARRANTY, INCLUDING OF MERCHANTABILITY, SATISFACTORY QUALITY AND FITNESS FOR A PARTICULAR PURPOSE. Please see the CERN OHL S v2 for applicable conditions.
- File:
- (in symbol CTE3528-21_47UF_6.3V_10%_LESR0250) +
- (in symbol MPM2001AT1, part A) 0.1%; 1k
- (in symbol MPM2001AT1, part B) 0.1%; 1k
- (in symbol R0402_6K8_1%_0.0625W_100PPM) 1%
- (in symbol R0402_100R_1%_0.0625W_100PPM) 1%

### Library data of the parts
ADC_OCTO_+2V5 ADC_OCTO_+5V ADC_QUAD_+2V5 ADC_QUAD_+5V CNV_ADC1 REF_ADC_OCTO REF_ADC_QUAD = SMD_PAD_1.27X1.27MM: 1.27mm x 1.27mm PCB Copper Area (SMD Test Point); Mounted: No; Part Number: SMD_PAD_1.27X1.27MM; Component Kind: Standard (No BOM); Component Type: Standard (No BOM); Pin Count: 1; Family: Test Point; Socket: No; SMD: Yes; Sense: No; Status: None; ComponentHeight: 0mm; HelpURL: Undefined; Author: CERN DEM JLC; CreateDate: 12/01/2008; LatestRevisionDate: 12/01/2008; PackageDescription: 1.27mm x 1.27mm PCB Copper Area (SMD Test Point)
C87 C150-C160 = CC0402_220PF_50V_5%_C0G: SMD Multilayer Chip Ceramic Capacitor; Manufacturer: GENERIC; Manufacturer1 Part Number: C0402C221J5GACTU; Voltage: 50V; TC: C0G/NP0; Tolerance: ±5%; Part Number: CC0402_220PF_50V_5%_C0G; Component Kind: Standard; Component Type: Standard; Pin Count: 2; Value: 220pF; Status: Preferred; Manufacturer Part Number: CC0402_220PF_50V_5%_C0G; Case: 0402; Mounted: Yes; Socket: No; SMD: Yes; Sense: No; Manufacturer1 Example: KEMET; Manufacturer1 ComponentHeight: 0.55mm; HelpURL: \\cern.ch\dfs\Applications\Altium\Datasheets\CC0805_C0G_KEMET_(Commercial Grade).pdf; Author: CERN DEM JLC; CreateDate: 03/12/2007; LatestRevisionDate: 22/04/2015
C98 C99 C104 C105 C111-C114 C116-C119 = CC0402_100NF_16V_10%_X7R: as C90 on sheet shift-registers; Part Number: CC0402_100NF_16V_10%_X7R; Component Kind: Standard; Component Type: Standard; Pin Count: 2; Value: 100nF; Status: Not Recommended; Manufacturer Part Number: CC0402_100NF_16V_10%_X7R; Case: 0402; Mounted: Yes; Socket: No; SMD: Yes; Sense: No; Manufacturer1 Example: MURATA; Manufacturer1 ComponentHeight: 0.55mm; HelpURL: \\cern.ch\dfs\Applications\Altium\Datasheets\CC0402_X7R_MURATA_GRM.pdf; Author: CERN DEM JLC; CreateDate: 05/12/2013; LatestRevisionDate: 03/12/2007
C100-C103 C106-C110 C115 C126 C130 = CC0805_10UF_25V_10%_X5R: SMD Multilayer Chip Ceramic Capacitor; Manufacturer: GENERIC; Manufacturer1 Part Number: GRM219R61E106KA12D; Voltage: 25V; TC: X5R; Tolerance: ±10%; Part Number: CC0805_10UF_25V_10%_X5R; Component Kind: Standard; Component Type: Standard; Pin Count: 2; Value: 10uF; Status: Preferred; Manufacturer Part Number: CC0805_10UF_25V_10%_X5R; Case: 0805; Mounted: Yes; Socket: No; SMD: Yes; Sense: No; Manufacturer1 Example: MURATA; Manufacturer1 ComponentHeight: 0.95mm; HelpURL: \\cern.ch\dfs\Applications\Altium\Datasheets\CC0805_X5R_MURATA_GRM.pdf; Author: CERN DEM JLC; CreateDate: 25/10/2012; LatestRevisionDate: 06/09/2016
C120 C123 = CC0805_1UF_16V_10%_X7R: SMD Multilayer Chip Ceramic Capacitor; Manufacturer: GENERIC; Manufacturer1 Part Number: C2012X7R1C105K125AA; Voltage: 16V; TC: X7R; Tolerance: ±10%; Part Number: CC0805_1UF_16V_10%_X7R; Component Kind: Standard; Component Type: Standard; Pin Count: 2; Value: 1uF; Status: Preferred; Manufacturer Part Number: CC0805_1UF_16V_10%_X7R; Case: 0805; Mounted: Yes; Socket: No; SMD: Yes; Sense: No; Manufacturer1 Example: TDK; Manufacturer1 ComponentHeight: 1.45mm; HelpURL: \\cern.ch\dfs\Applications\Altium\Datasheets\CC0805_X7R_TDK_C.pdf; Author: CERN DEM JLC; CreateDate: 03/12/2007; LatestRevisionDate: 22/04/2015
C121 C122 C124 C125 = CTE3528-21_47UF_6.3V_10%_LESR0250: Low ESR 0R25 Solid Tantalum Chip Capacitor; Manufacturer: GENERIC; Manufacturer1 Part Number: TPSB476K006R0250; Voltage: 6.3V; Tolerance: ±10%; Part Number: CTE3528-21_47UF_6.3V_10%_LESR0250; Component Kind: Standard; Component Type: Standard; Pin Count: 2; Value: 47uF; Status: Preferred; Manufacturer Part Number: CTE3528-21_47UF_6.3V_10%_LESR0250; Case: B; Mounted: Yes; Socket: No; SMD: Yes; Sense: No; Manufacturer1 Example: AVX; Manufacturer1 ComponentHeight: 2.1mm; HelpURL: \\cern.ch\dfs\Applications\Altium\Datasheets\CTE-LESR_AVX_TPS.pdf; Author: CERN DEM JLC; CreateDate: 05/05/2008; LatestRevisionDate: 20/01/2009
C127 C131 = CC0603_100NF_50V_10%_X7R: SMD Multilayer Chip Ceramic Capacitor; Manufacturer: GENERIC; Manufacturer1 Part Number: 223858615649; Voltage: 50V; TC: X7R; Tolerance: ±10%; Part Number: CC0603_100NF_50V_10%_X7R; Component Kind: Standard; Component Type: Standard; Pin Count: 2; Value: 100nF; Status: Preferred; Manufacturer Part Number: CC0603_100NF_50V_10%_X7R; Case: 0603; Mounted: Yes; Socket: No; SMD: Yes; Sense: No; Manufacturer1 Example: PHYCOMP; Manufacturer1 ComponentHeight: 0.87mm; HelpURL: \\cern.ch\dfs\Applications\Altium\Datasheets\CC0603_X7R_PHYCOMP.pdf; Author: CERN DEM JLC; CreateDate: 03/12/2007; LatestRevisionDate: 03/12/2007
C128 C129 = CC0805_100NF_50V_10%_X7R: SMD Multilayer Chip Ceramic Capacitor; Manufacturer: GENERIC; Manufacturer1 Part Number: C2012X7R1H104K085AA; Voltage: 50V; TC: X7R; Tolerance: ±10%; Part Number: CC0805_100NF_50V_10%_X7R; Component Kind: Standard; Component Type: Standard; Pin Count: 2; Value: 100nF; Status: Preferred; Manufacturer Part Number: CC0805_100NF_50V_10%_X7R; Case: 0805; Mounted: Yes; Socket: No; SMD: Yes; Sense: No; Manufacturer1 Example: TDK; Manufacturer1 ComponentHeight: 1mm; HelpURL: \\cern.ch\dfs\Applications\Altium\Datasheets\CC0805_X7R_TDK_C.pdf; Author: CERN DEM JLC; CreateDate: 03/12/2007; LatestRevisionDate: 22/04/2015
IC38 = LTC2320CUKG-16: Octal, 16-Bit, 1.5Msps/Ch Simultaneous Sampling ADC  (0 - 70°C operating range); Manufacturer: LINEAR TECHNOLOGY; PressFit: No; Bonding: No; Part Number: LTC2320CUKG-16; Component Kind: Standard; Component Type: Standard; Device: LTC2320CUKG-16; PackageDescription: QFP, 0.50mm pitch, square; 12 pin X 14 pin, 7.00mm X 8.00mm, IPC Medium Density; Manufacturer Part Number: LTC2320CUKG-16; Pin Count: 53; Case: QFN52; Mounted: Yes; Socket: No; SMD: Yes; Sense: No; ComponentHeight: 0.8mm; Author: LNLS DIG AFG; CreateDate: 03/09/2020; LatestRevisionDate: 03/09/2020
IC39 = LTC2324CUKG-16: Quad, 16-Bit, 2Msps/Ch Simultaneous Sampling ADC (0 - 70°C operating range); Manufacturer: LINEAR TECHNOLOGY; PressFit: No; Bonding: No; Part Number: LTC2324CUKG-16; Component Kind: Standard; Component Type: Standard; Device: LTC2324CUKG-16; PackageDescription: QFP, 0.50mm pitch, square; 12 pin X 14 pin, 7.00mm X 8.00mm, IPC Medium Density; Manufacturer Part Number: LTC2324CUKG-16; Pin Count: 53; Case: QFN52; Mounted: Yes; Socket: No; SMD: Yes; Sense: No; ComponentHeight: 0.8mm; Author: LNLS DIG AFG; CreateDate: 02/09/2020; LatestRevisionDate: 03/09/2020
IC41 = OP2177ARMZ: Dual, Precision Low Noise, Low Input Bias Current Operational Amplifiers; Manufacturer: ANALOG DEVICES; PressFit: No; Bonding: No; Part Number: OP2177ARMZ; Component Kind: Standard; Component Type: Standard; Device: OP2177ARMZ; PackageDescription: SOP, 0.65mm pitch; 8 pin, 3.00mm W X 3.00mm L X 1.10mm H body, IPC Medium Density; Manufacturer Part Number: OP2177ARMZ; Pin Count: 8; Case: MSOP8; Mounted: Yes; Socket: No; SMD: Yes; Sense: No; ComponentHeight: 1.1mm; Author: LNLS DIG AFG; CreateDate: 11/06/2020; LatestRevisionDate: 11/06/2020
L21-L26 = IND0603_MURATA_BLM18AG102SN1D: SMD EMIFIL Suppression Chip Ferrite Bead; Manufacturer: MURATA; Power: 400mA; Resistance: 0.50R; Tolerance: ±25%; Part Number: IND0603_MURATA_BLM18AG102SN1D; Component Kind: Standard; Component Type: Standard; Pin Count: 2; Value: 1K@100MHz; Status: None; Manufacturer Part Number: BLM18AG102SN1D; Case: 0603; Mounted: Yes; Socket: No; SMD: Yes; Sense: No; ComponentHeight: 0.95mm; Author: LNLS DIG GBMB; CreateDate: 03/11/2017; LatestRevisionDate: 03/11/2017
R19 R135-R137 = R0402_6K8_1%_0.0625W_100PPM: General Purpose Thick Film Chip Resistor; Manufacturer: GENERIC; Manufacturer1 Part Number: 232270676802L; TC: ±100ppm/°C; Tolerance: ±1%; Part Number: R0402_6K8_1%_0.0625W_100PPM; Component Kind: Standard; Component Type: Standard; Pin Count: 2; Value: 6k8; Status: Not recommended; Power: 0.0625W; Manufacturer Part Number: R0402_6K8_1%_0.0625W_100PPM; Case: 0402; Mounted: Yes; Sense: No; Socket: No; SMD: Yes; Manufacturer1 Example: YAGEO PHYCOMP; Manufacturer1 ComponentHeight: 0.4mm; HelpURL: \\cern.ch\dfs\Applications\Altium\Datasheets\R0402_Phycomp_RC0402.pdf; Author: CERN DEM JLC; CreateDate: 03/12/2007; LatestRevisionDate: 17/10/2012
R103 R104 = R0402_100R_1%_0.0625W_100PPM: General Purpose Thick Film Chip Resistor; Manufacturer: GENERIC; Manufacturer1 Part Number: 232270671001L; TC: ±100ppm/°C; Tolerance: ±1%; Part Number: R0402_100R_1%_0.0625W_100PPM; Component Kind: Standard; Component Type: Standard; Pin Count: 2; Value: 100; Status: Not recommended; Power: 0.0625W; Manufacturer Part Number: R0402_100R_1%_0.0625W_100PPM; Case: 0402; Mounted: Yes; Sense: No; Socket: No; SMD: Yes; Manufacturer1 Example: YAGEO PHYCOMP; Manufacturer1 ComponentHeight: 0.4mm; HelpURL: \\cern.ch\dfs\Applications\Altium\Datasheets\R0402_Phycomp_RC0402.pdf; Author: CERN DEM JLC; CreateDate: 03/12/2007; LatestRevisionDate: 17/10/2012
RN2 RN3 = MPM2001AT1: Divider, Thin Film Resistors Network; Manufacturer: VISHAY THIN FILM; Power: 0.1W; TC: ±25ppm/°C; Tolerance: ±0.1%; Voltage: 100V; Part Number: MPM2001AT1; Component Kind: Standard; Component Type: Standard; Pin Count: 3; Value: 1k 1k; Sense: no; Manufacturer Part Number: MPM2001AT1; Case: SOT23-3; Mounted: Yes; Socket: No; SMD: Yes; ComponentHeight: 1.22mm; HelpURL: \\cern.ch\dfs\Applications\Altium\Datasheets\RN_VISHAY_MPM.pdf; Author: LNLS DIG AFG; CreateDate: 11/05/2020; LatestRevisionDate: 11/05/2020